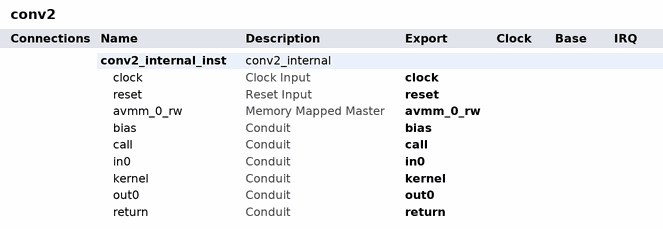
[diagram p0: system contents]
# Platform Designer (Qsys) system conv2, Cyclone V 5CGXFC7C7F23C8
# Parameters at their usual value, and those the tool derives, are not listed.
package require qsys
create_system conv2
set_project_property DEVICE_FAMILY {Cyclone V}
set_project_property DEVICE 5CGXFC7C7F23C8

add_instance conv2_internal_inst conv2_internal 1.0
set_instance_property conv2_internal_inst AUTO_EXPORT true

# exported interfaces
add_interface avmm_0_rw avalon master
set_interface_property avmm_0_rw EXPORT_OF conv2_internal_inst.avmm_0_rw
add_interface bias conduit end
set_interface_property bias EXPORT_OF conv2_internal_inst.bias
add_interface call conduit end
set_interface_property call EXPORT_OF conv2_internal_inst.call
add_interface clock clock sink
set_interface_property clock EXPORT_OF conv2_internal_inst.clock
add_interface in0 conduit end
set_interface_property in0 EXPORT_OF conv2_internal_inst.in0
add_interface kernel conduit end
set_interface_property kernel EXPORT_OF conv2_internal_inst.kernel
add_interface out0 conduit end
set_interface_property out0 EXPORT_OF conv2_internal_inst.out0
add_interface reset reset sink
set_interface_property reset EXPORT_OF conv2_internal_inst.reset
add_interface return conduit end
set_interface_property return EXPORT_OF conv2_internal_inst.return

set_interconnect_requirement {$system} qsys_mm.clockCrossingAdapter HANDSHAKE
set_interconnect_requirement {$system} qsys_mm.enableEccProtection FALSE
set_interconnect_requirement {$system} qsys_mm.insertDefaultSlave FALSE
set_interconnect_requirement {$system} qsys_mm.maxAdditionalLatency 1

save_system conv2.qsys
